# Altium schematic sheet fpga_radio.SchDoc
size A; SheetNumber: 1
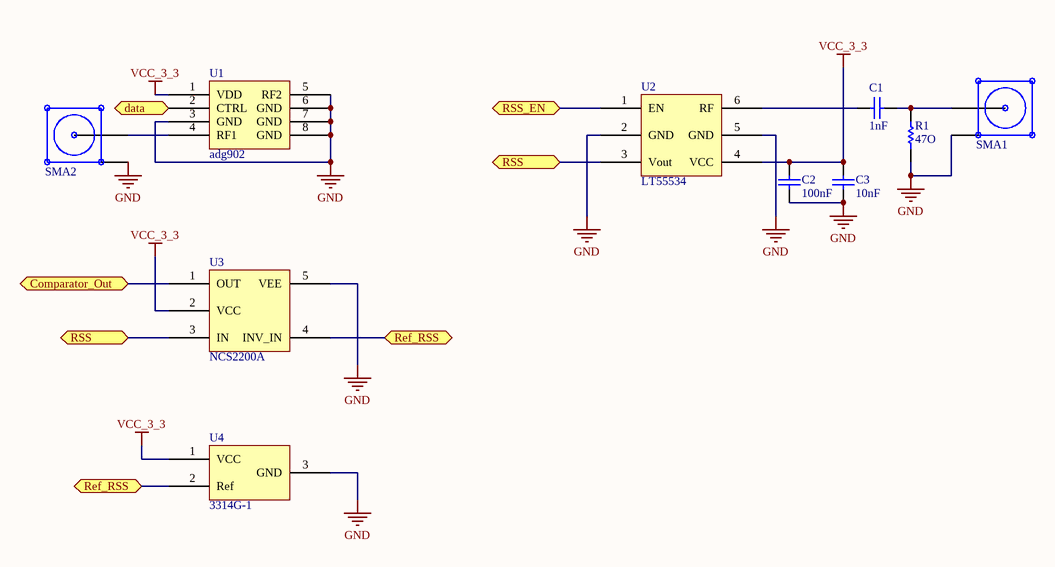
[diagram p0: fpga_radio.SchDoc]

## Parts
C1  value 1nF  [0603]  (hidden comment: Cap)
C2  value 100nF  [0603]  (hidden comment: Cap)
C3  value 10nF  [0603]  (hidden comment: Cap)
R1  value 47O  [0603]  (hidden comment: Res)
SMA1  SMA - Hole - 5 Pin  [SMA - Hole - 5 Pin]  (value not drawn)
SMA2  SMA - Hole - 5 Pin  [SMA - Hole - 5 Pin]  (value not drawn)
U1  adg902  [ADG902]
U2  LT55534  [LT5534]
U3  NCS2200A  [NCS2200]
U4  3314G-1  [3314G-1]

## Ports
Comparator_Out, data, Ref_RSS, RSS, RSS_EN

## Nets
GND: C2.1 C3.1 R1.1 SMA1.1 SMA2.1 U1.3(GND) U1.5(RF2) U1.6(GND) U1.7(GND) U1.8(GND) U2.2(GND) U2.5(GND) U3.5(VEE) U4.3(GND)
VCC_3_3: C2.2 C3.2 U1.1(VDD) U2.4(VCC) U3.2(VCC) U4.1(VCC)
Comparator_Out: U3.1(OUT) ; port Comparator_Out
data: U1.2(CTRL) ; port data
Ref_RSS: U3.4(INV_IN) U4.2(Ref) ; port Ref_RSS
RSS: U2.3(Vout) U3.3(IN) ; port RSS
RSS_EN: U2.1(EN) ; port RSS_EN
NetC1_1: C1.1 U2.6(RF)
NetC1_2: C1.2 R1.2 SMA1.2
NetSMA2_2: SMA2.2 U1.4(RF1)

## Library data of the parts
C1-C3 = Cap: Ceramic Capacitor (Surface Mount); Manufacturer: Generic Ceramic Chip Cap (TBD); Digi-Key Part Number: *; Manufacturer Part Number: *; Note: *; Rating: *
R1 = Res: Chip Resistor (Surface Mount); Manufacturer: Generic Chip Res (TBD); Manufacturer Part Number: *; Digi-Key Part Number: *; Rating: *
SMA1 SMA2 = SMA - Hole - 5 Pin: SMA - Through Hole Connector; Manufacturer Part Number: *; Manufacturer: *; Digi-Key Part Number: *; Note: *